# Altium project LED-Driver.PrjPCB
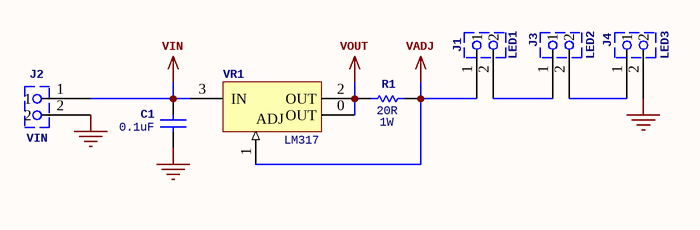
[diagram p0: LED-Driver.SchDoc]
1 sheet, 7 parts. Net scope: global (net labels, ports and power ports of the same name join across sheets).
Board file: LED-Driver.PcbDoc

## Sheet LED-Driver.SchDoc: Power LED Driver Board
size A4; Author: DMH; DrawnBy: DMH; Engineer: DMH; Revision: A0; SheetNumber: 1; SheetTotal: 1

### Parts
C1  value 0.1uF  [C1206]  (hidden comment: Cap Semi)
J1  LED1  [JMP2]
J2  VIN  [JMP2]
J3  LED2  [JMP2]
J4  LED3  [JMP2]
R1  1W  value 20R  [RES500]
VR1  LM317  [TO-220_HeatSinked]

### Nets
GND: C1.1 J2.2 J4.2
VADJ: J1.1 R1.2 VR1.1(ADJ)
VIN: C1.2 J2.1 VR1.3(IN)
VOUT: R1.1 VR1.0(OUT) VR1.2(OUT)
NetJ1_2: J1.2 J3.1
NetJ3_2: J3.2 J4.1

### Notes on the sheet
- Title
- Size:
- Date:
- A4
- Number:
- Time:
- Revision:
- Sheet
- of
- File:

### Library data of the parts
C1 = Cap Semi: Capacitor (Semiconductor SIM Model); Published: 8-Jun-2000; LatestRevisionDate: 29-May-2009; LatestRevisionNote: IPC-7351 Footprint Added.; PackageReference: C1206; Publisher: Altium Limited; PackageDescription: Chip Capacitor
J1-J4 = JUMPER_2: Value: *
R1 = Res1: Resistor; Published: 8-Jun-2000; LatestRevisionDate: 17-Jul-2002; LatestRevisionNote: Re-released for DXP Platform.; PackageReference: AXIAL-0.3; Publisher: Altium Limited; PackageDescription: Axial Device, Thru-Hole; 2 Leads; 0.3 in Pin Spacing
VR1 = CMP-0062-02452-2: 3-Terminal Adjustable Regulator, 3-pin TO-220, Pb-Free; Manufacturer: National Semiconductor; CompType: LDO IC; PowerWise: N; PackageTopMarking: NSUZXYTTE#*LM317AT P+; PackageReference: T03B; PackageDescription: TO-220, Molded, 3 Lead, Straight; RoHS: Y; ComponentLink1Description: LM317 Datasheet; DatasheetVersion: Apr-2007; ComponentLink2Description: LM317 Web Page; ComponentLink3Description: T03B Package Page; PinCount: 3; ComponentLink3URL: http://www.national.com/packaging/folders/t03b.html; ComponentLink2URL: http://www.national.com/pf/LM/LM317.html; PackageVersion: revL, Jan-1992; ComponentLink1URL: http://www.national.com/ds/LM/LM317.pdf; RevisionNote: Component URLs added